# Altium schematic sheet fpga.SchDoc
size A3
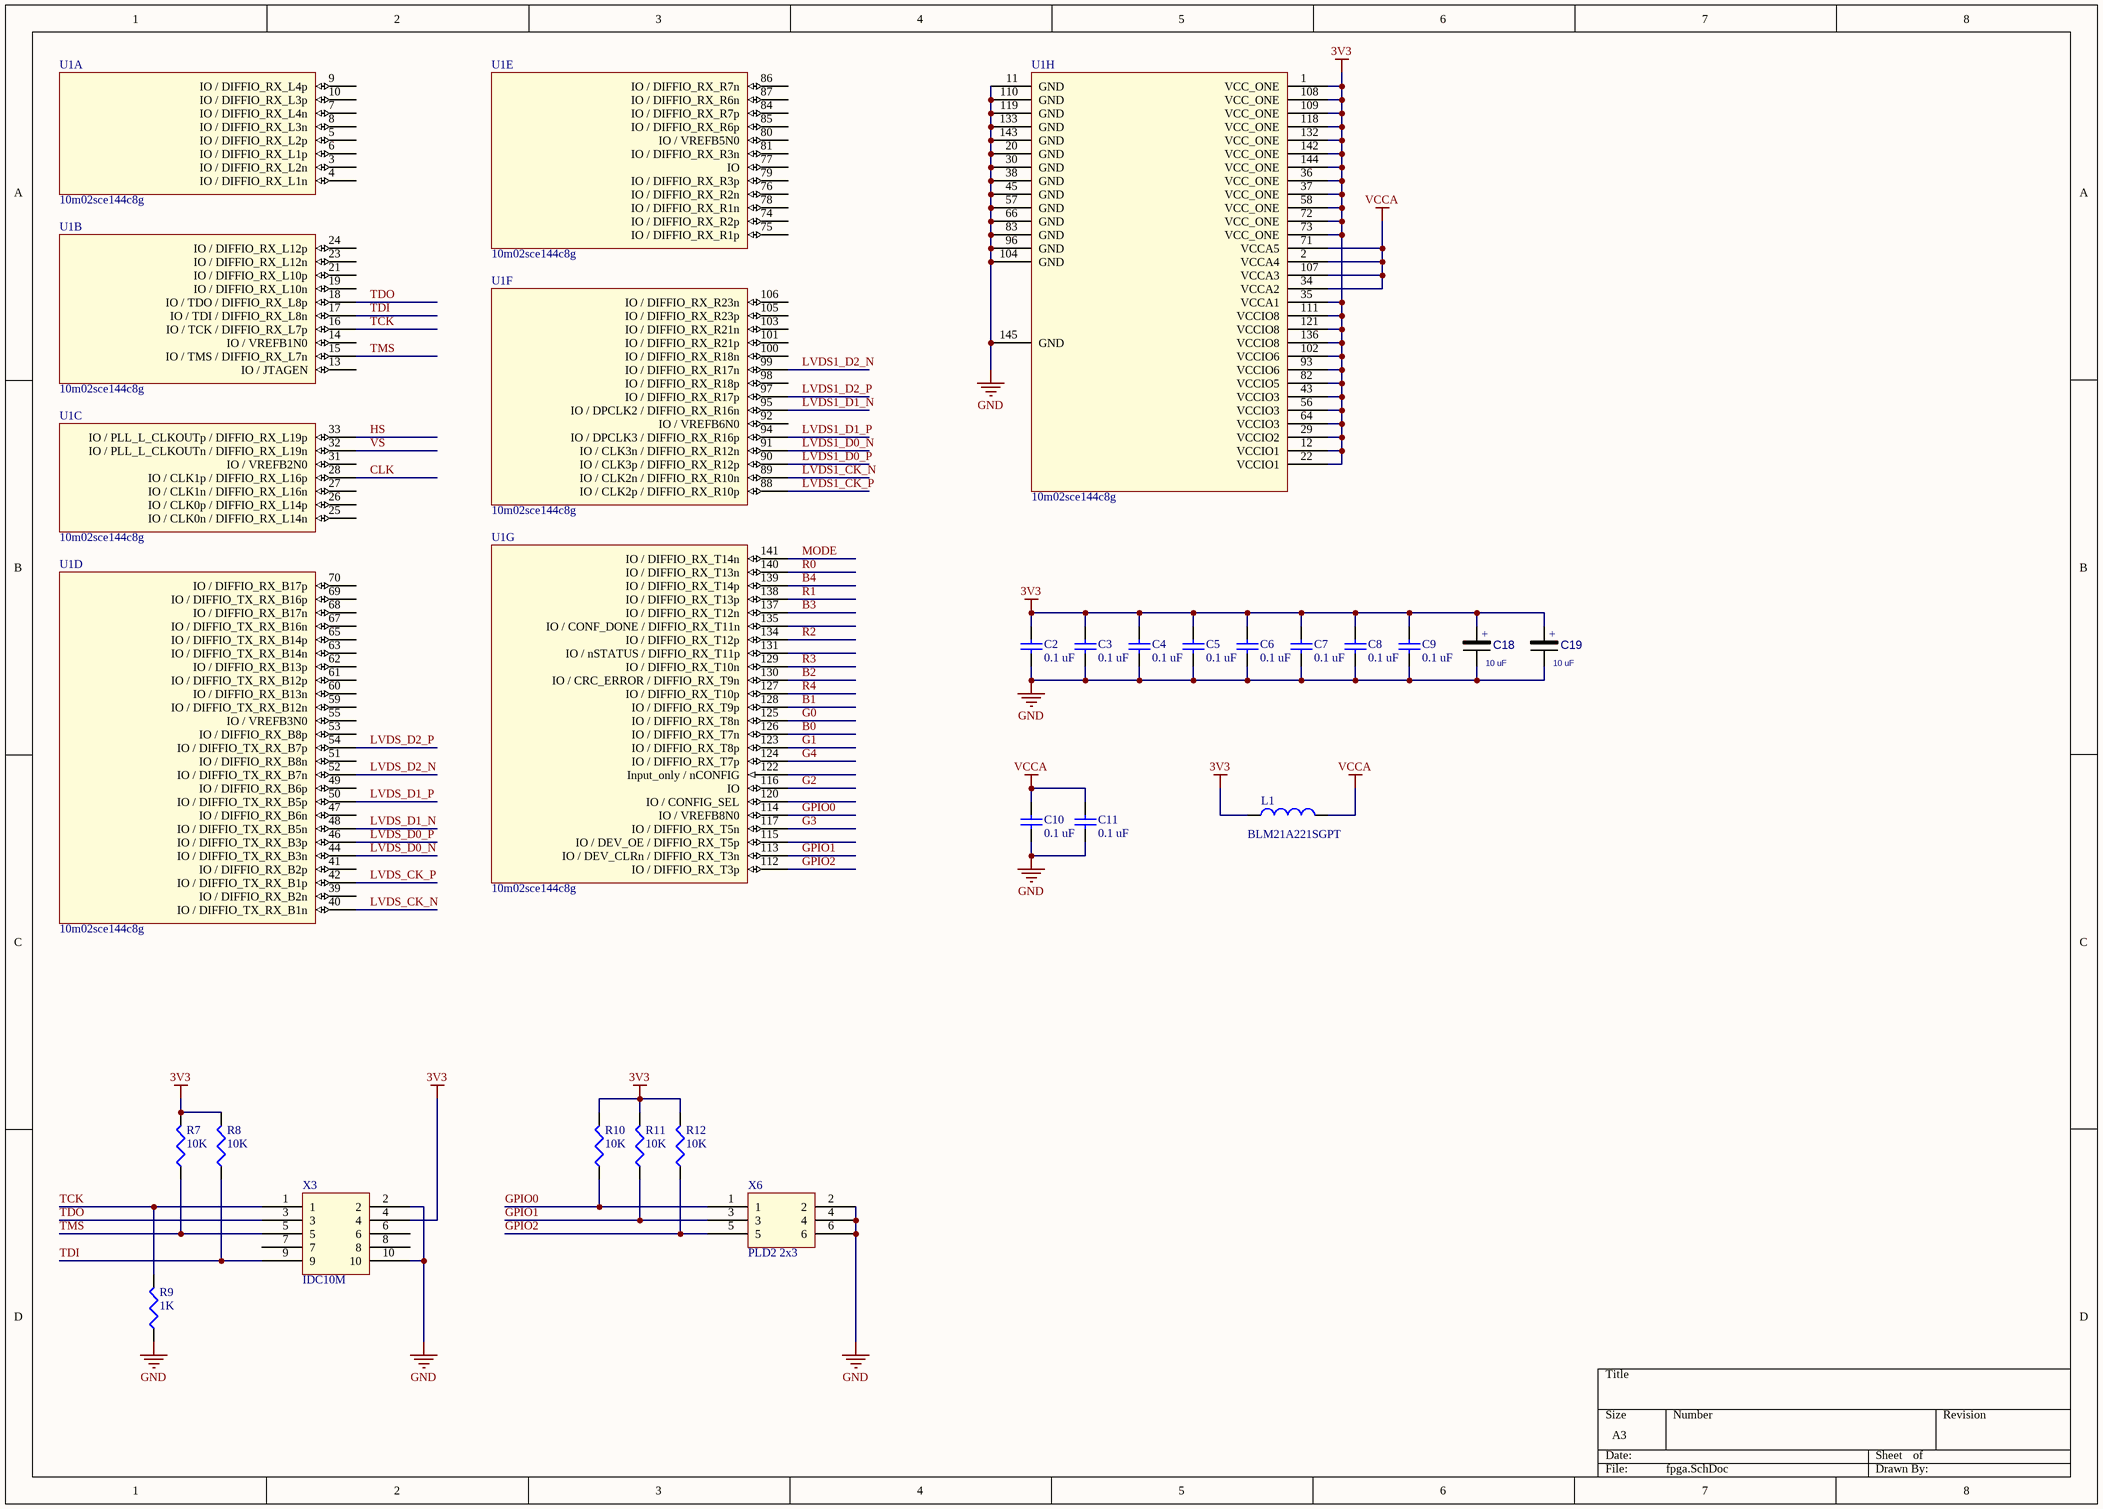
[diagram p0: fpga.SchDoc]

## Parts
C2  0.1 uF  [0805 chip cap]
C3  0.1 uF  [0805 chip cap]
C4  0.1 uF  [0805 chip cap]
C5  0.1 uF  [0805 chip cap]
C6  0.1 uF  [0805 chip cap]
C7  0.1 uF  [0805 chip cap]
C8  0.1 uF  [0805 chip cap]
C9  0.1 uF  [0805 chip cap]
C10  0.1 uF  [0805 chip cap]
C11  0.1 uF  [0805 chip cap]
C18  10 uF  [CAP CASE-A]
C19  10 uF  [CAP CASE-A]
L1  BLM21A221SGPT  [0805 CHIP RES]
R7  10K  [0805 CHIP RES]
R8  10K  [0805 CHIP RES]
R9  1K  [0805 CHIP RES]
R10  10K  [0805 CHIP RES]
R11  10K  [0805 CHIP RES]
R12  10K  [0805 CHIP RES]
U1  10m02sce144c8g  [Altera TQFP 50P 22X22 145N]  (parts A,B,C,D,E,F,G,H of 8)
X3  IDC10M  [PLD2-10]
X6  PLD2 2x3  [PLD2-6]

## Nets
3V3: C2.2 C3.2 C4.2 C5.2 C6.2 C7.2 C8.2 C9.2 C18.1 C19.1 L1.1 R7.2 R8.2 R10.2 R11.2 R12.2 U1.1(VCC_ONE) U1.12(VCCIO1) U1.22(VCCIO1) U1.29(VCCIO2) U1.35(VCCA1) U1.36(VCC_ONE) U1.37(VCC_ONE) U1.43(VCCIO3) U1.56(VCCIO3) U1.58(VCC_ONE) U1.64(VCCIO3) U1.72(VCC_ONE) U1.73(VCC_ONE) U1.82(VCCIO5) U1.93(VCCIO6) U1.102(VCCIO6) U1.108(VCC_ONE) U1.109(VCC_ONE) U1.111(VCCIO8) U1.118(VCC_ONE) U1.121(VCCIO8) U1.132(VCC_ONE) U1.136(VCCIO8) U1.142(VCC_ONE) U1.144(VCC_ONE) X3.4
GND: C2.1 C3.1 C4.1 C5.1 C6.1 C7.1 C8.1 C9.1 C10.1 C11.1 C18.2 C19.2 R9.1 U1.11(GND) U1.20(GND) U1.30(GND) U1.38(GND) U1.45(GND) U1.57(GND) U1.66(GND) U1.83(GND) U1.96(GND) U1.104(GND) U1.110(GND) U1.119(GND) U1.133(GND) U1.143(GND) U1.145(GND) X3.2 X3.10 X6.2 X6.4 X6.6
VCCA: C10.2 C11.2 L1.2 U1.2(VCCA4) U1.34(VCCA2) U1.71(VCCA5) U1.107(VCCA3)
B0: U1.126(IO_/_DIFFIO_RX_T7n)
B1: U1.128(IO_/_DIFFIO_RX_T9p)
B2: U1.130(IO_/_CRC_ERROR_/_DIFFIO_RX_T9n)
B3: U1.137(IO_/_DIFFIO_RX_T12n)
B4: U1.139(IO_/_DIFFIO_RX_T14p)
CLK: U1.28(IO_/_CLK1p_/_DIFFIO_RX_L16p)
G0: U1.125(IO_/_DIFFIO_RX_T8n)
G1: U1.123(IO_/_DIFFIO_RX_T8p)
G2: U1.116(IO)
G3: U1.117(IO_/_DIFFIO_RX_T5n)
G4: U1.124(IO_/_DIFFIO_RX_T7p)
GPIO0: R10.1 U1.114(IO_/_VREFB8N0) X6.1
GPIO1: R11.1 U1.113(IO_/_DEV_CLRn_/_DIFFIO_RX_T3n) X6.3
GPIO2: R12.1 U1.112(IO_/_DIFFIO_RX_T3p) X6.5
HS: U1.33(IO_/_PLL_L_CLKOUTp_/_DIFFIO_RX_L19p)
LVDS1_CK_N: U1.89(IO_/_CLK2n_/_DIFFIO_RX_R10n)
LVDS1_CK_P: U1.88(IO_/_CLK2p_/_DIFFIO_RX_R10p)
LVDS1_D0_N: U1.91(IO_/_CLK3n_/_DIFFIO_RX_R12n)
LVDS1_D0_P: U1.90(IO_/_CLK3p_/_DIFFIO_RX_R12p)
LVDS1_D1_N: U1.95(IO_/_DPCLK2_/_DIFFIO_RX_R16n)
LVDS1_D1_P: U1.94(IO_/_DPCLK3_/_DIFFIO_RX_R16p)
LVDS1_D2_N: U1.99(IO_/_DIFFIO_RX_R17n)
LVDS1_D2_P: U1.97(IO_/_DIFFIO_RX_R17p)
LVDS_CK_N: U1.40(IO_/_DIFFIO_TX_RX_B1n)
LVDS_CK_P: U1.42(IO_/_DIFFIO_TX_RX_B1p)
LVDS_D0_N: U1.44(IO_/_DIFFIO_TX_RX_B3n)
LVDS_D0_P: U1.46(IO_/_DIFFIO_TX_RX_B3p)
LVDS_D1_N: U1.48(IO_/_DIFFIO_TX_RX_B5n)
LVDS_D1_P: U1.50(IO_/_DIFFIO_TX_RX_B5p)
LVDS_D2_N: U1.52(IO_/_DIFFIO_TX_RX_B7n)
LVDS_D2_P: U1.54(IO_/_DIFFIO_TX_RX_B7p)
MODE: U1.141(IO_/_DIFFIO_RX_T14n)
R0: U1.140(IO_/_DIFFIO_RX_T13n)
R1: U1.138(IO_/_DIFFIO_RX_T13p)
R2: U1.134(IO_/_DIFFIO_RX_T12p)
R3: U1.129(IO_/_DIFFIO_RX_T10n)
R4: U1.127(IO_/_DIFFIO_RX_T10p)
TCK: R9.2 U1.16(IO_/_TCK_/_DIFFIO_RX_L7p) X3.1
TDI: R8.1 U1.17(IO_/_TDI_/_DIFFIO_RX_L8n) X3.9
TDO: U1.18(IO_/_TDO_/_DIFFIO_RX_L8p) X3.3
TMS: R7.1 U1.15(IO_/_TMS_/_DIFFIO_RX_L7n) X3.5
VS: U1.32(IO_/_PLL_L_CLKOUTn_/_DIFFIO_RX_L19n)

Not connected (* = marked no-connect by the designer): U1 3(IO_/_DIFFIO_RX_L2n) 4(IO_/_DIFFIO_RX_L1n) 5(IO_/_DIFFIO_RX_L2p) 6(IO_/_DIFFIO_RX_L1p) 7(IO_/_DIFFIO_RX_L4n) 8(IO_/_DIFFIO_RX_L3n) 9(IO_/_DIFFIO_RX_L4p) 10(IO_/_DIFFIO_RX_L3p) 13(IO_/_JTAGEN) 14(IO_/_VREFB1N0) 19(IO_/_DIFFIO_RX_L10n) 21(IO_/_DIFFIO_RX_L10p) 23(IO_/_DIFFIO_RX_L12n) 24(IO_/_DIFFIO_RX_L12p) 25(IO_/_CLK0n_/_DIFFIO_RX_L14n) 26(IO_/_CLK0p_/_DIFFIO_RX_L14p) 27(IO_/_CLK1n_/_DIFFIO_RX_L16n) 31(IO_/_VREFB2N0) 39(IO_/_DIFFIO_RX_B2n) 41(IO_/_DIFFIO_RX_B2p) 47(IO_/_DIFFIO_RX_B6n) 49(IO_/_DIFFIO_RX_B6p) 51(IO_/_DIFFIO_RX_B8n) 53(IO_/_DIFFIO_RX_B8p) 55(IO_/_VREFB3N0) 59(IO_/_DIFFIO_TX_RX_B12n) 60(IO_/_DIFFIO_RX_B13n) 61(IO_/_DIFFIO_TX_RX_B12p) 62(IO_/_DIFFIO_RX_B13p) 63(IO_/_DIFFIO_TX_RX_B14n) 65(IO_/_DIFFIO_TX_RX_B14p) 67(IO_/_DIFFIO_TX_RX_B16n) 68(IO_/_DIFFIO_RX_B17n) 69(IO_/_DIFFIO_TX_RX_B16p) 70(IO_/_DIFFIO_RX_B17p) 74(IO_/_DIFFIO_RX_R2p) 75(IO_/_DIFFIO_RX_R1p) 76(IO_/_DIFFIO_RX_R2n) 77(IO) 78(IO_/_DIFFIO_RX_R1n) 79(IO_/_DIFFIO_RX_R3p) 80(IO_/_VREFB5N0) 81(IO_/_DIFFIO_RX_R3n) 84(IO_/_DIFFIO_RX_R7p) 85(IO_/_DIFFIO_RX_R6p) 86(IO_/_DIFFIO_RX_R7n) 87(IO_/_DIFFIO_RX_R6n) 92(IO_/_VREFB6N0) 98(IO_/_DIFFIO_RX_R18p) 100(IO_/_DIFFIO_RX_R18n) 101(IO_/_DIFFIO_RX_R21p) 103(IO_/_DIFFIO_RX_R21n) 105(IO_/_DIFFIO_RX_R23p) 106(IO_/_DIFFIO_RX_R23n) 115(IO_/_DEV_OE_/_DIFFIO_RX_T5p) 120(IO_/_CONFIG_SEL) 122(Input_only_/_nCONFIG) 131(IO_/_nSTATUS_/_DIFFIO_RX_T11p) 135(IO_/_CONF_DONE_/_DIFFIO_RX_T11n); X3 6 7 8

## Notes on the sheet
- (in symbol CAP POL CASE A) +

## Library data of the parts
C2-C11 = Cap: Capacitor; Value: 0.1 uF
C18 C19 = CAP POL CASE A: Value: 10 uF
L1 = BLM21A221SGPT: CHIP FERRITE BEADS 220R AT 100Mhz; Value: 220R at 100Mhz
R7-R12 = CHIP RES: Resistor
  R7 R8 R10-R12: Value: 10K
  R9: Value: 1K
U1 = 10m02sce144c8g: FPGA MAX10
X3 = PLD2-10
X6 = PLD2-6